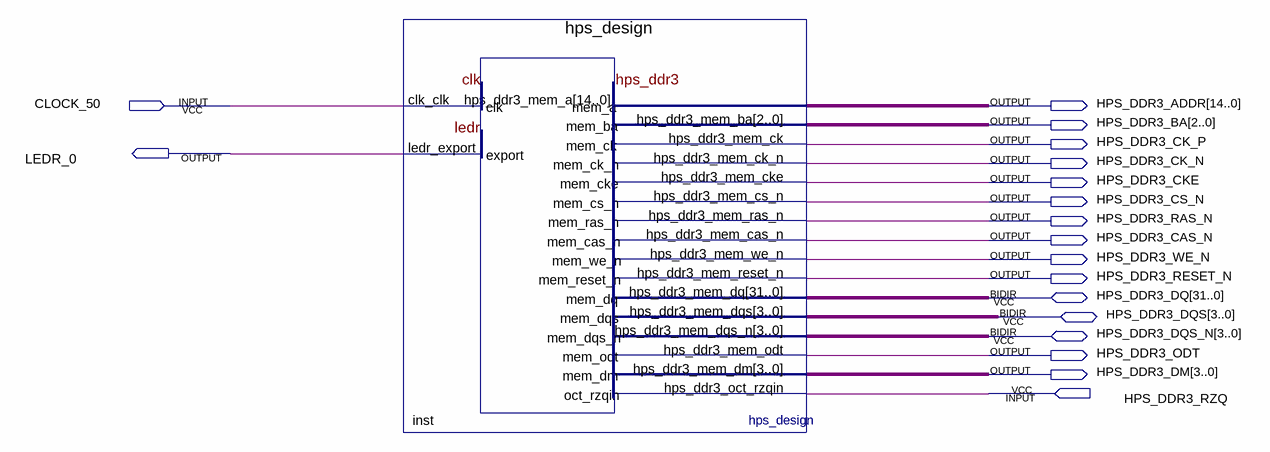
[diagram p0: schematic sheet]
// Quartus schematic chris_HPS.bdf as structural Verilog: 1 symbols, 18 pins
module chris_HPS (
  input  CLOCK_50,
  input  HPS_DDR3_RZQ,
  inout  [31:0] HPS_DDR3_DQ,
  inout  [3:0] HPS_DDR3_DQS,
  inout  [3:0] HPS_DDR3_DQS_N,
  output [14:0] HPS_DDR3_ADDR,
  output [2:0] HPS_DDR3_BA,
  output HPS_DDR3_CK_P,
  output LEDR_0,
  output HPS_DDR3_CK_N,
  output HPS_DDR3_CKE,
  output HPS_DDR3_CS_N,
  output HPS_DDR3_RAS_N,
  output HPS_DDR3_CAS_N,
  output HPS_DDR3_WE_N,
  output HPS_DDR3_RESET_N,
  output HPS_DDR3_ODT,
  output [3:0] HPS_DDR3_DM
);

  hps_design inst (
    .clk_clk(CLOCK_50), .hps_ddr3_oct_rzqin(HPS_DDR3_RZQ), .hps_ddr3_mem_a(HPS_DDR3_ADDR),
    .hps_ddr3_mem_ba(HPS_DDR3_BA), .hps_ddr3_mem_ck(HPS_DDR3_CK_P), .hps_ddr3_mem_ck_n(HPS_DDR3_CK_N),
    .hps_ddr3_mem_cke(HPS_DDR3_CKE), .hps_ddr3_mem_cs_n(HPS_DDR3_CS_N), .hps_ddr3_mem_ras_n(HPS_DDR3_RAS_N),
    .hps_ddr3_mem_cas_n(HPS_DDR3_CAS_N), .hps_ddr3_mem_we_n(HPS_DDR3_WE_N),
    .hps_ddr3_mem_reset_n(HPS_DDR3_RESET_N), .hps_ddr3_mem_odt(HPS_DDR3_ODT), .hps_ddr3_mem_dm(HPS_DDR3_DM),
    .ledr_export(LEDR_0), .hps_ddr3_mem_dq(HPS_DDR3_DQ), .hps_ddr3_mem_dqs(HPS_DDR3_DQS),
    .hps_ddr3_mem_dqs_n(HPS_DDR3_DQS_N));
endmodule
